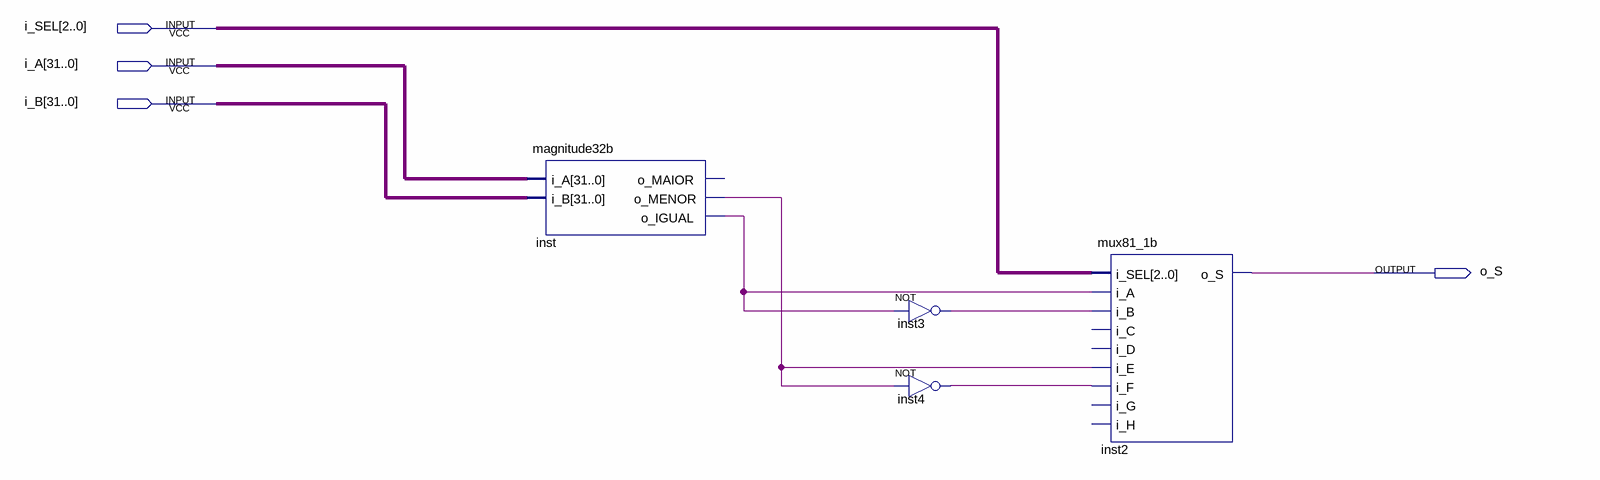
[diagram p0: schematic sheet]
// Quartus schematic branch_control.bdf as structural Verilog: 4 symbols, 4 pins
module branch_control (
  input  [2:0] i_SEL,
  input  [31:0] i_A,
  input  [31:0] i_B,
  output o_S
);

  wire inst3_out, inst4_out, inst_o_igual, inst_o_menor;

  magnitude32b inst (.i_A(i_A), .i_B(i_B), .o_MENOR(inst_o_menor), .o_IGUAL(inst_o_igual));  // open: o_MAIOR
  not inst3 (inst3_out, inst_o_igual);
  not inst4 (inst4_out, inst_o_menor);
  mux81_1b inst2 (
    .i_SEL(i_SEL), .i_A(inst_o_igual), .i_B(inst3_out), .i_E(inst_o_menor), .i_F(inst4_out), .o_S(o_S));  // open: i_C, i_D, i_G, i_H
endmodule
